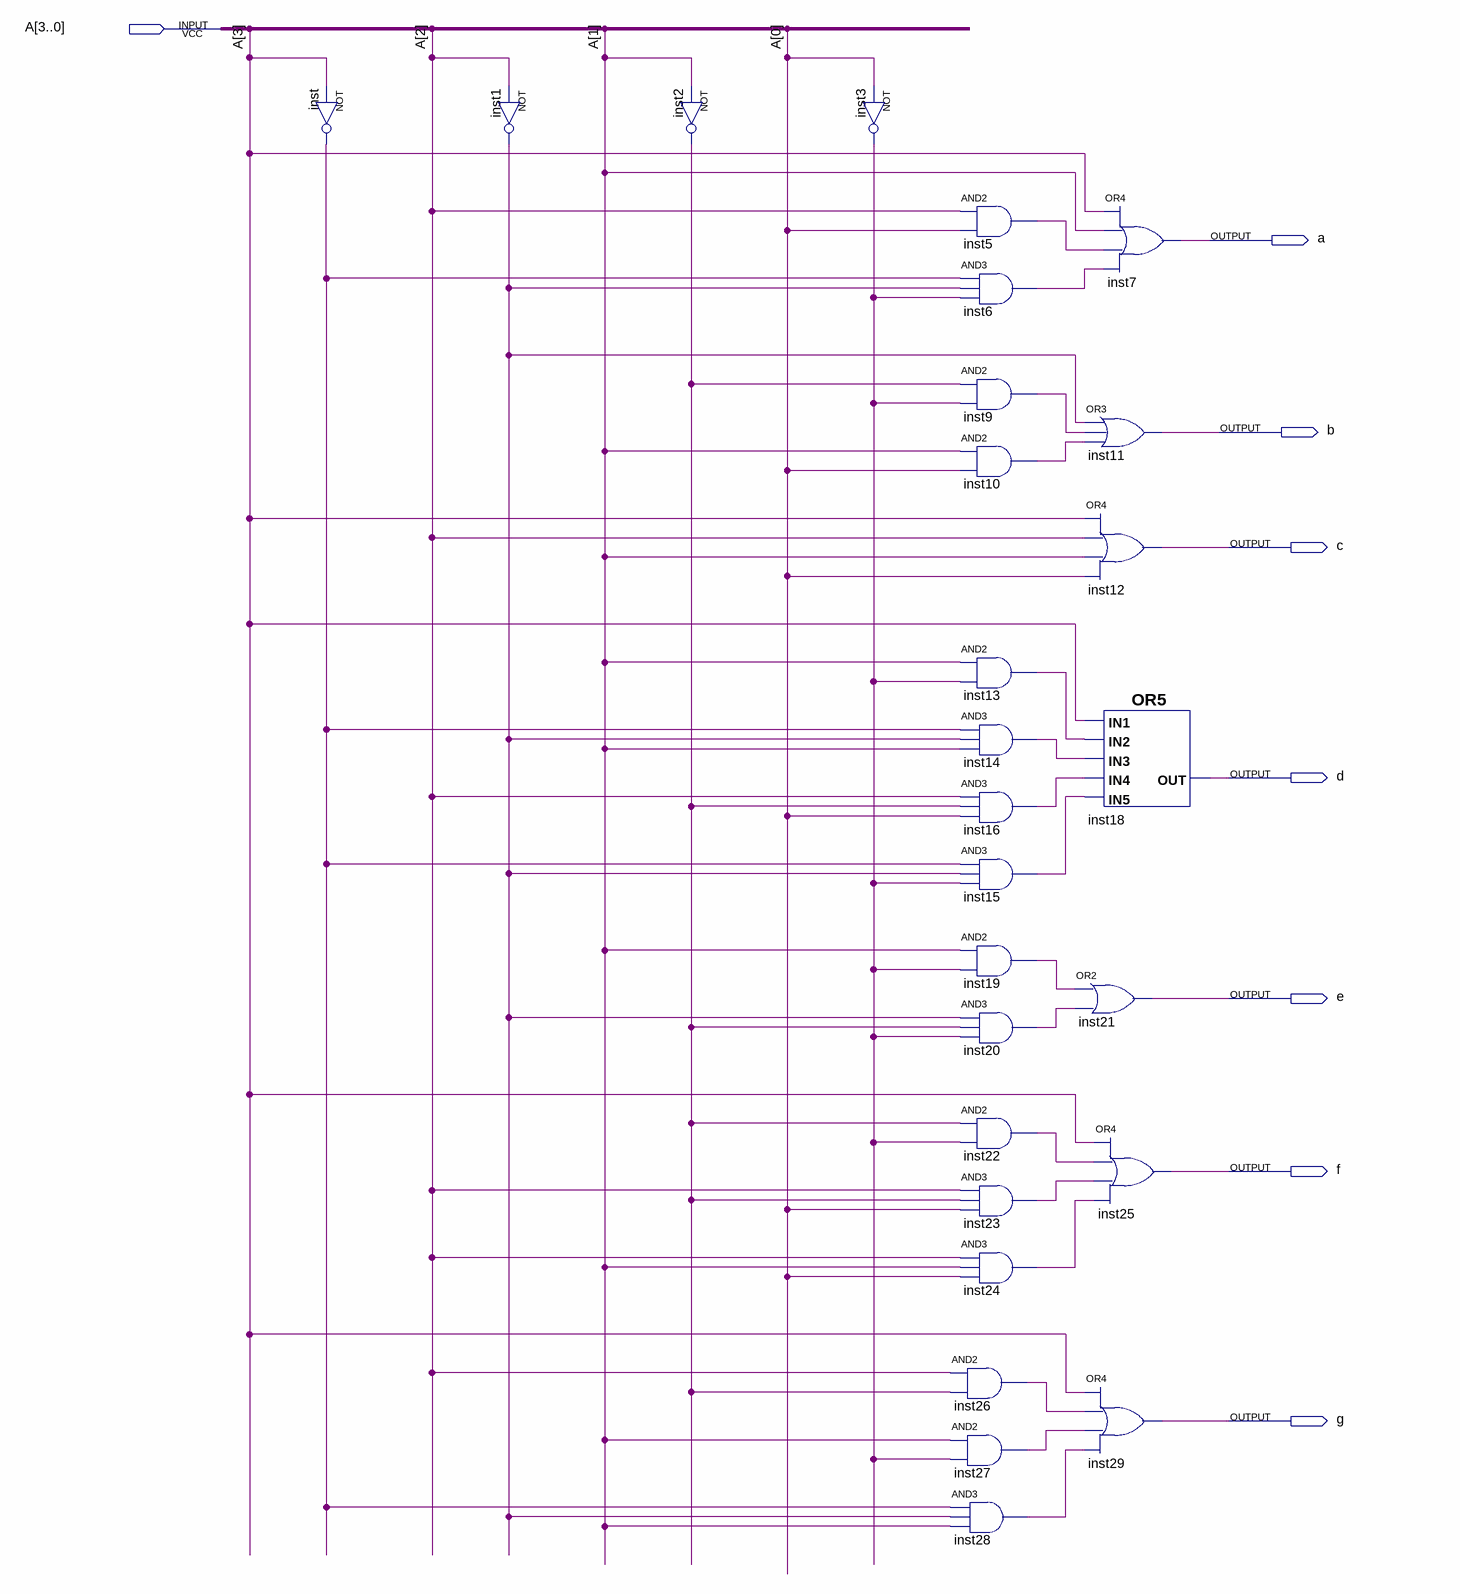
[diagram p0: schematic sheet]
// Quartus schematic Display0a9.bdf as structural Verilog: 27 symbols, 8 pins
module Display0a9 (
  input  [3:0] A,
  output A_1bit,
  output b,
  output c,
  output d,
  output e,
  output f,
  output g
);

  wire inst1_out, inst2_out, inst3_out, inst5_out, inst6_out, inst9_out, inst10_out, inst13_out, inst14_out,
       inst15_out, inst16_out, inst19_out, inst20_out, inst22_out, inst23_out, inst24_out, inst26_out,
       inst27_out, inst28_out, inst_out;

  not inst (inst_out, A[3]);
  not inst1 (inst1_out, A[2]);
  not inst2 (inst2_out, A[1]);
  not inst3 (inst3_out, A[0]);
  and inst26 (inst26_out, A[2], inst2_out);
  and inst27 (inst27_out, A[1], inst3_out);
  and inst28 (inst28_out, inst_out, inst1_out, A[1]);
  and inst5 (inst5_out, A[2], A[0]);
  and inst6 (inst6_out, inst_out, inst1_out, inst3_out);
  and inst9 (inst9_out, inst2_out, inst3_out);
  and inst10 (inst10_out, A[1], A[0]);
  and inst13 (inst13_out, A[1], inst3_out);
  and inst14 (inst14_out, inst_out, inst1_out, A[1]);
  and inst16 (inst16_out, A[2], inst2_out, A[0]);
  and inst15 (inst15_out, inst_out, inst1_out, inst3_out);
  and inst19 (inst19_out, A[1], inst3_out);
  and inst20 (inst20_out, inst1_out, inst2_out, inst3_out);
  and inst22 (inst22_out, inst2_out, inst3_out);
  and inst23 (inst23_out, A[2], inst2_out, A[0]);
  and inst24 (inst24_out, A[2], A[1], A[0]);
  or inst7 (A_1bit, A[3], A[1], inst5_out, inst6_out);
  or inst11 (b, inst1_out, inst9_out, inst10_out);
  or inst12 (c, A[3], A[2], A[1], A[0]);
  or inst18 (d, A[3], inst13_out, inst14_out, inst16_out, inst15_out);
  or inst21 (e, inst19_out, inst20_out);
  or inst25 (f, A[3], inst22_out, inst23_out, inst24_out);
  or inst29 (g, A[3], inst26_out, inst27_out, inst28_out);
endmodule
